# EAGLE schematic Power supply (EAGLE 9.3.0)

## Sheet 1 of 2
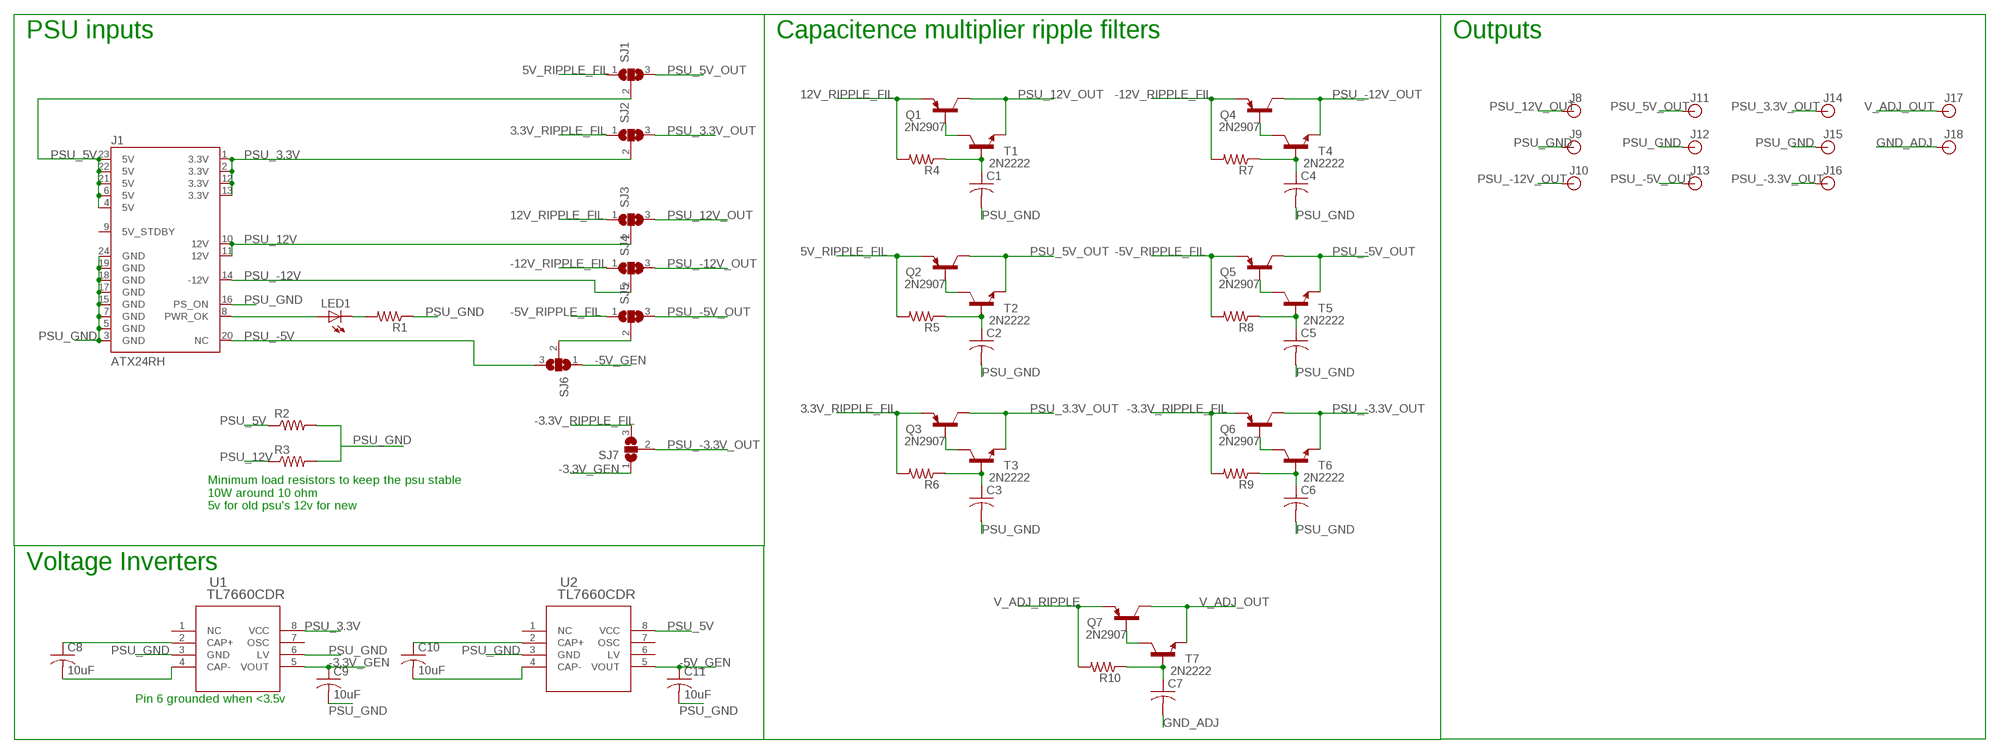
[diagram p0: schematic, sheet 1]

### Parts
C1  C-USC0603  [C0603]
C2  C-USC0603  [C0603]
C3  C-USC0603  [C0603]
C4  C-USC0603  [C0603]
C5  C-USC0603  [C0603]
C6  C-USC0603  [C0603]
C7  C-USC0603  [C0603]
C8  10uF  C-USC0603  [C0603]
C9  10uF  C-USC0603  [C0603]
C10  10uF  C-USC0603  [C0603]
C11  10uF  C-USC0603  [C0603]
J1  ATX24RH  [ATX24_RIGHT_ANGLE]
J8  BANANA_CONN  [BANANA_CONN]
J9  BANANA_CONN  [BANANA_CONN]
J10  BANANA_CONN  [BANANA_CONN]
J11  BANANA_CONN  [BANANA_CONN]
J12  BANANA_CONN  [BANANA_CONN]
J13  BANANA_CONN  [BANANA_CONN]
J14  BANANA_CONN  [BANANA_CONN]
J15  BANANA_CONN  [BANANA_CONN]
J16  BANANA_CONN  [BANANA_CONN]
J17  BANANA_CONN  [BANANA_CONN]
J18  BANANA_CONN  [BANANA_CONN]
LED1  LED3MM  [LED3MM]
Q1  2N2907  [TO92-EBC-OVAL]
Q2  2N2907  [TO92-EBC-OVAL]
Q3  2N2907  [TO92-EBC-OVAL]
Q4  2N2907  [TO92-EBC-OVAL]
Q5  2N2907  [TO92-EBC-OVAL]
Q6  2N2907  [TO92-EBC-OVAL]
Q7  2N2907  [TO92-EBC-OVAL]
R1  R-US_R0603  [R0603]
R2  R-US_0613/15  [P0613/15]
R3  R-US_0613/15  [P0613/15]
R4  R-US_R0603  [R0603]
R5  R-US_R0603  [R0603]
R6  R-US_R0603  [R0603]
R7  R-US_R0603  [R0603]
R8  R-US_R0603  [R0603]
R9  R-US_R0603  [R0603]
R10  R-US_R0603  [R0603]
SJ1  SJ2WW  [SJ_2W]
SJ2  SJ2WW  [SJ_2W]
SJ3  SJ2WW  [SJ_2W]
SJ4  SJ2WW  [SJ_2W]
SJ5  SJ2WW  [SJ_2W]
SJ6  SJ2WW  [SJ_2W]
SJ7  SJ2WW  [SJ_2W]
T1  2N2222  [TO92-EBC-OVAL]
T2  2N2222  [TO92-EBC-OVAL]
T3  2N2222  [TO92-EBC-OVAL]
T4  2N2222  [TO92-EBC-OVAL]
T5  2N2222  [TO92-EBC-OVAL]
T6  2N2222  [TO92-EBC-OVAL]
T7  2N2222  [TO92-EBC-OVAL]
U1  TL7660CDR  [D8]
U2  TL7660CDR  [D8]

### Nets
3.3V_RIPPLE_FIL: Q3.E R6.2 SJ2.1
5V_RIPPLE_FIL: Q2.E R5.2 SJ1.1
12V_RIPPLE_FIL: Q1.E R4.2 SJ3.1
-3.3V_GEN: C9.1 SJ7.1 U1.5(VOUT)
-3.3V_RIPPLE_FIL: Q6.E R9.2 SJ7.3
-5V_GEN: C11.1 SJ6.1 U2.5(VOUT)
-5V_RIPPLE_FIL: Q5.E R8.2 SJ5.1
-12V_RIPPLE_FIL: Q4.E R7.2 SJ4.1
GND_ADJ: C7.2 J18.P$1
N$1: J1.8(PWR_OK) LED1.A
N$2: LED1.K(C) R1.2
N$3: C1.1 R4.1 T1.B
N$4: SJ5.2 SJ6.2
N$5: Q1.B T1.C
N$6: Q7.B T7.C
N$7: C8.1 U1.2(CAP+)
N$8: Q2.B T2.C
N$9: C8.2 U1.4(CAP-)
N$10: C7.1 R10.1 T7.B
N$11: C2.1 R5.1 T2.B
N$12: Q3.B T3.C
N$15: C3.1 R6.1 T3.B
N$16: Q4.B T4.C
N$19: C4.1 R7.1 T4.B
N$20: Q5.B T5.C
N$21: C10.1 U2.2(CAP+)
N$22: C10.2 U2.4(CAP-)
N$23: C5.1 R8.1 T5.B
N$24: Q6.B T6.C
N$27: C6.1 R9.1 T6.B
PSU_3.3V: J1.1(3.3V) J1.2(3.3V) J1.12(3.3V) J1.13(3.3V) SJ2.2 U1.8(VCC)
PSU_3.3V_OUT: J14.P$1 Q3.C SJ2.3 T3.E
PSU_5V: J1.4(5V) J1.6(5V) J1.21(5V) J1.22(5V) J1.23(5V) R2.1 SJ1.2 U2.8(VCC)
PSU_5V_OUT: J11.P$1 Q2.C SJ1.3 T2.E
PSU_12V: J1.10(12V) J1.11(12V) R3.1 SJ3.2
PSU_12V_OUT: J8.P$1 Q1.C SJ3.3 T1.E
PSU_-3.3V_OUT: J16.P$1 Q6.C SJ7.2 T6.E
PSU_-5V: J1.20(NC) SJ6.3
PSU_-5V_OUT: J13.P$1 Q5.C SJ5.3 T5.E
PSU_-12V: J1.14(-12V) SJ4.2
PSU_-12V_OUT: J10.P$1 Q4.C SJ4.3 T4.E
PSU_GND: C1.2 C2.2 C3.2 C4.2 C5.2 C6.2 C9.2 C11.2 J1.3(GND) J1.5(GND) J1.7(GND) J1.15(GND) J1.16(PS_ON) J1.17(GND) J1.18(GND) J1.19(GND) J1.24(GND) J9.P$1 J12.P$1 J15.P$1 R1.1 R2.2 R3.2 U1.3(GND) U1.6(LV) U2.3(GND)
V_ADJ_OUT: J17.P$1 Q7.C T7.E
V_ADJ_RIPPLE: Q7.E R10.2
Unconnected: J1.9(5V_STDBY) U1.1(NC) U1.7(OSC) U2.1(NC) U2.6(LV) U2.7(OSC)

### Notes on the sheet
- PSU inputs | Capacitence multiplier ripple filters | Outputs
- Minimum load resistors to keep the psu stable
  10W around 10 ohm
  5v for old psu's 12v for new
- Voltage Inverters
- Pin 6 grounded when <3.5v

## Sheet 2 of 2
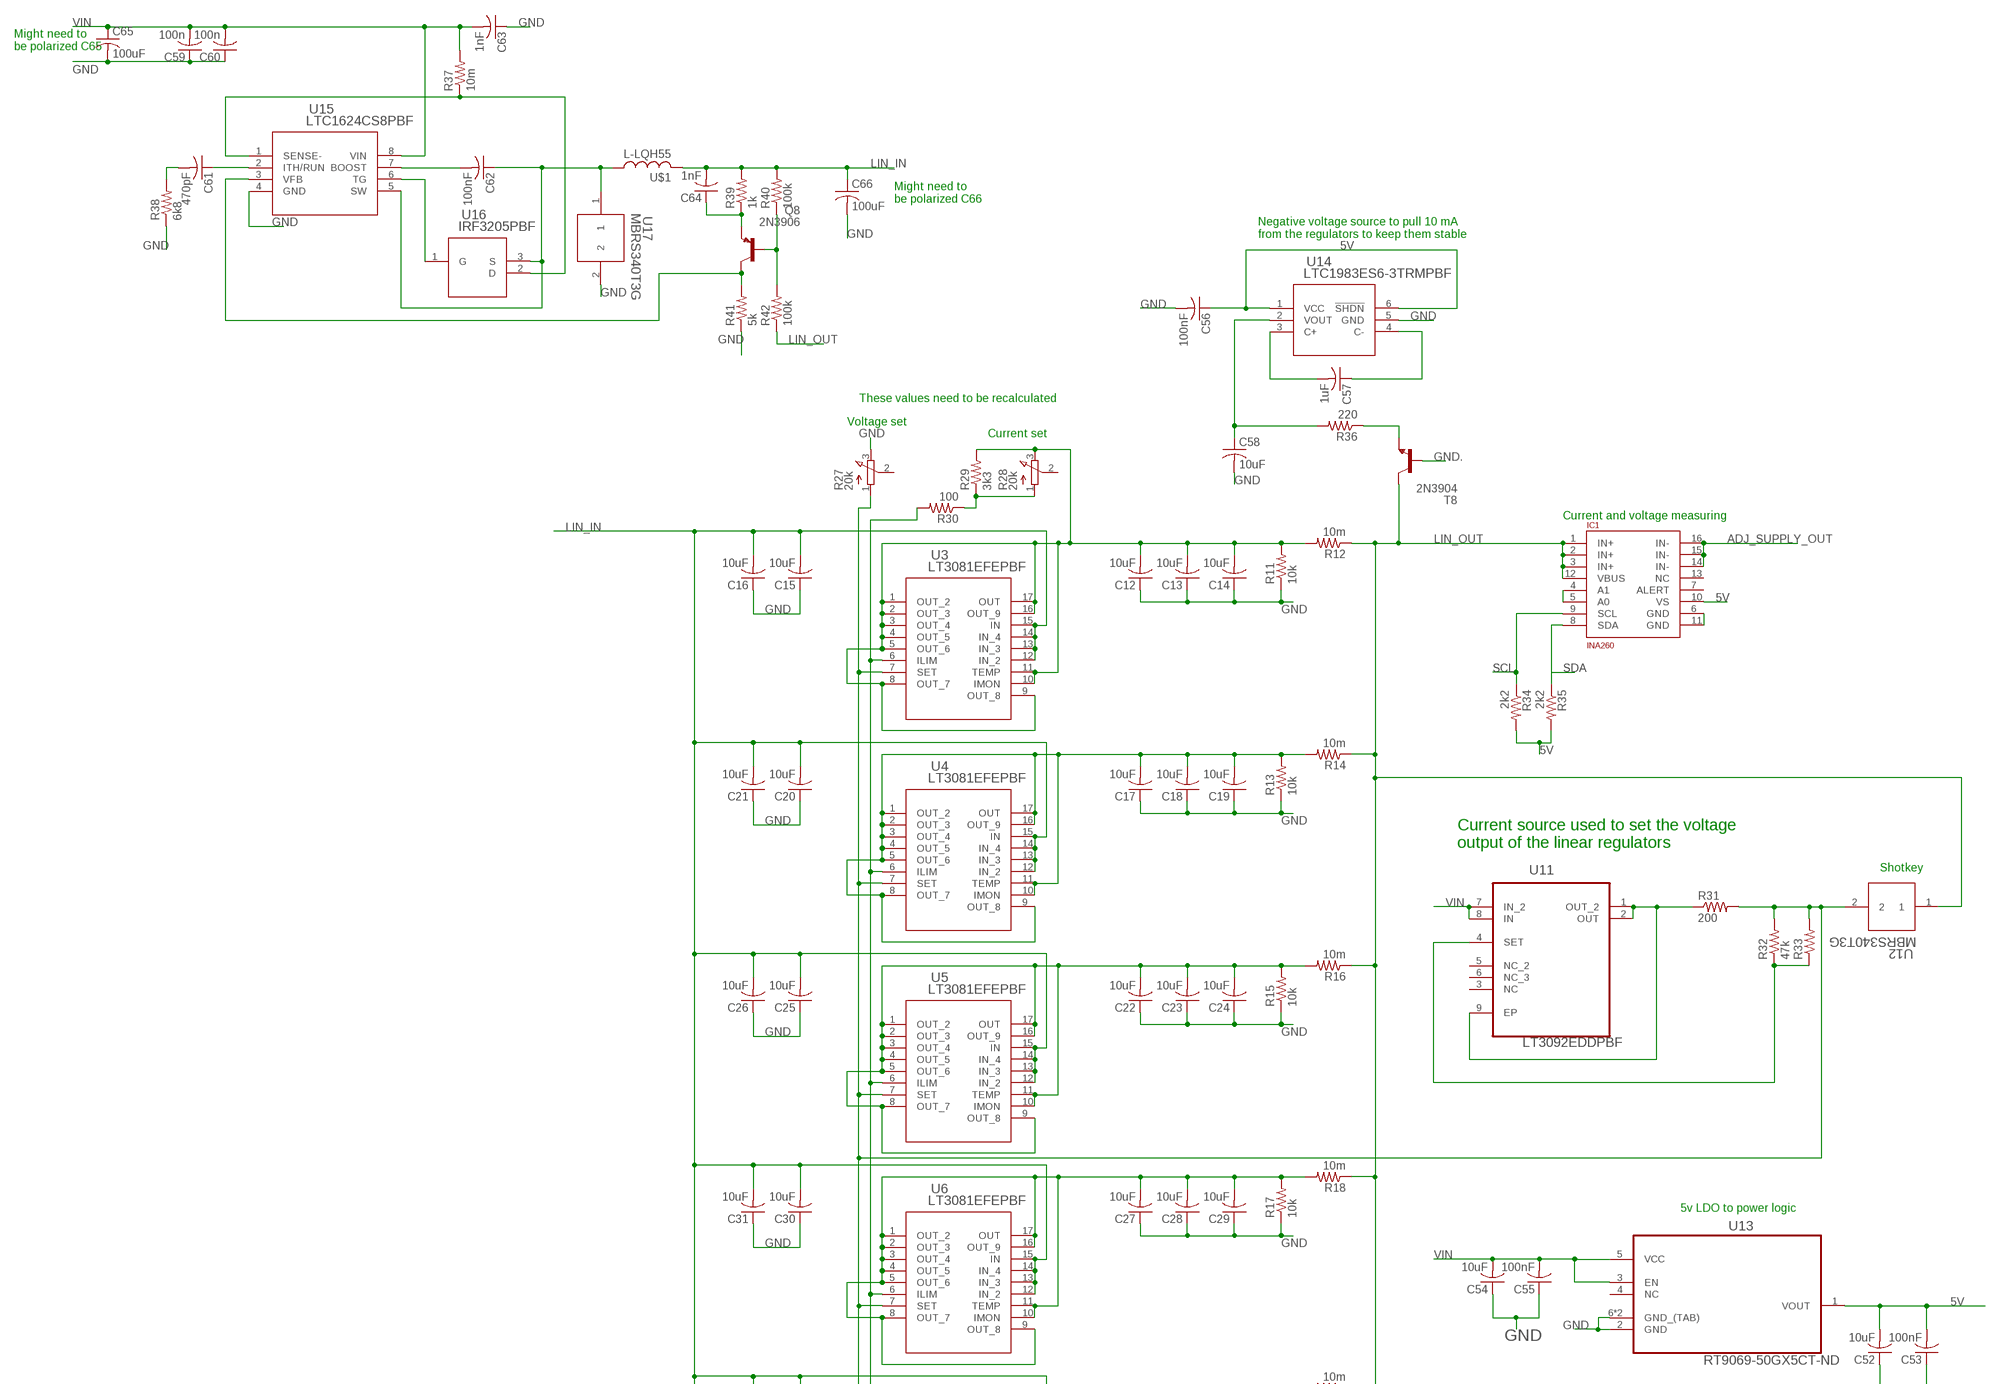
[diagram p1: schematic, sheet 2, part 1 of 2]
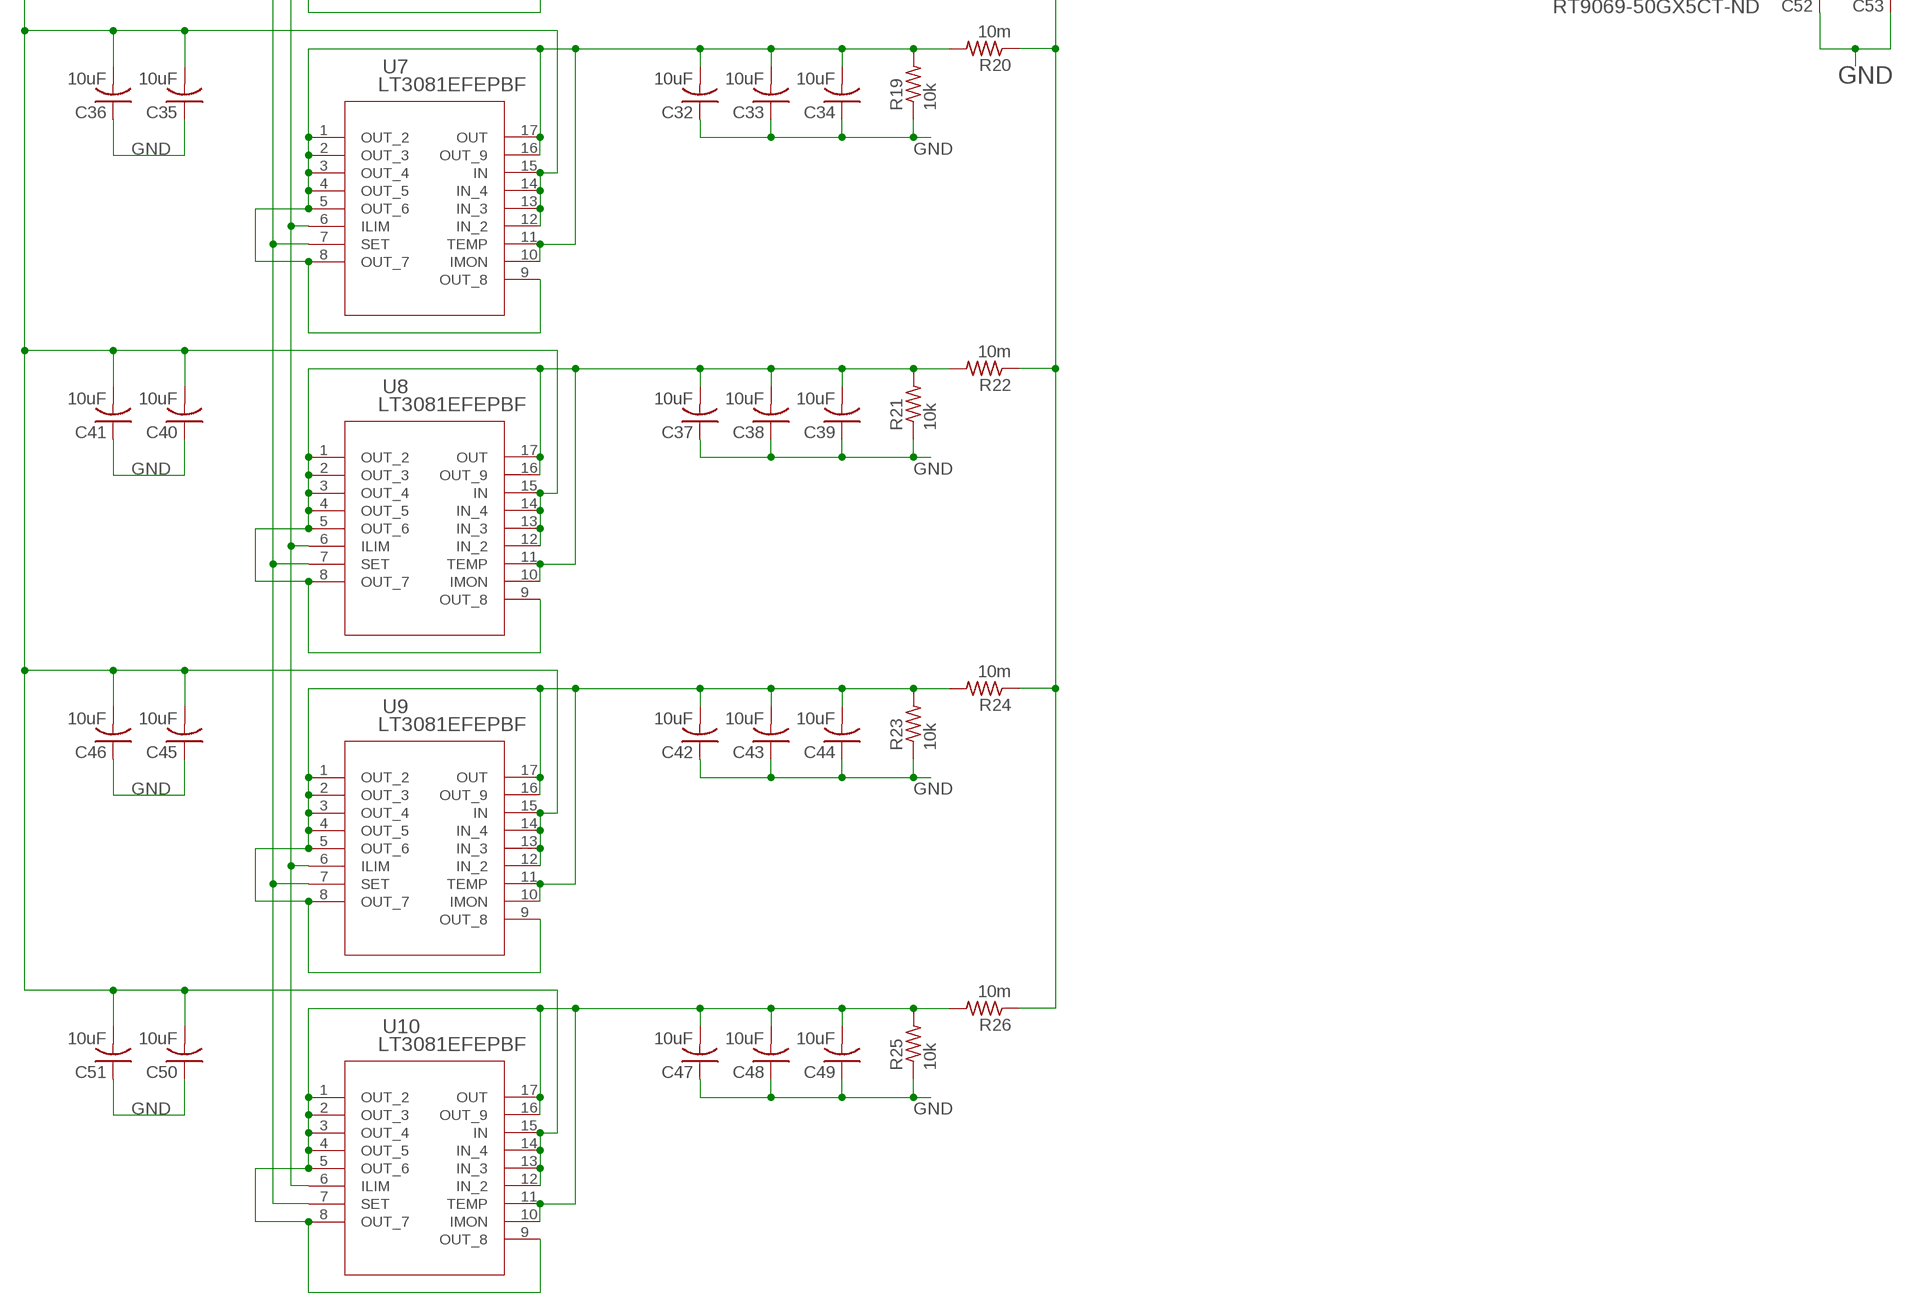
[diagram p2: schematic, sheet 2, part 2 of 2]

### Parts
C12  10uF  C-USC0805  [C0805]
C13  10uF  C-USC0805  [C0805]
C14  10uF  C-USC0805  [C0805]
C15  10uF  C-USC0805  [C0805]
C16  10uF  C-USC0805  [C0805]
C17  10uF  C-USC0805  [C0805]
C18  10uF  C-USC0805  [C0805]
C19  10uF  C-USC0805  [C0805]
C20  10uF  C-USC0805  [C0805]
C21  10uF  C-USC0805  [C0805]
C22  10uF  C-USC0805  [C0805]
C23  10uF  C-USC0805  [C0805]
C24  10uF  C-USC0805  [C0805]
C25  10uF  C-USC0805  [C0805]
C26  10uF  C-USC0805  [C0805]
C27  10uF  C-USC0805  [C0805]
C28  10uF  C-USC0805  [C0805]
C29  10uF  C-USC0805  [C0805]
C30  10uF  C-USC0805  [C0805]
C31  10uF  C-USC0805  [C0805]
C32  10uF  C-USC0805  [C0805]
C33  10uF  C-USC0805  [C0805]
C34  10uF  C-USC0805  [C0805]
C35  10uF  C-USC0805  [C0805]
C36  10uF  C-USC0805  [C0805]
C37  10uF  C-USC0805  [C0805]
C38  10uF  C-USC0805  [C0805]
C39  10uF  C-USC0805  [C0805]
C40  10uF  C-USC0805  [C0805]
C41  10uF  C-USC0805  [C0805]
C42  10uF  C-USC0805  [C0805]
C43  10uF  C-USC0805  [C0805]
C44  10uF  C-USC0805  [C0805]
C45  10uF  C-USC0805  [C0805]
C46  10uF  C-USC0805  [C0805]
C47  10uF  C-USC0805  [C0805]
C48  10uF  C-USC0805  [C0805]
C49  10uF  C-USC0805  [C0805]
C50  10uF  C-USC0805  [C0805]
C51  10uF  C-USC0805  [C0805]
C52  10uF  C-USC0805  [C0805]
C53  100nF  C-USC0805  [C0805]
C54  10uF  C-USC0805  [C0805]
C55  100nF  C-USC0805  [C0805]
C56  100nF  C-USC0805  [C0805]
C57  1uF  C-USC0805  [C0805]
C58  10uF  C-USC0805  [C0805]
C59  100n  C-USC0805  [C0805]
C60  100n  C-USC0805  [C0805]
C61  470pF  C-USC0805  [C0805]
C62  100nF  C-USC0805  [C0805]
C63  1nF  C-USC0805  [C0805]
C64  1nF  C-USC0805  [C0805]
C65  100uF  C-USC0805  [C0805]
C66  100uF  C-USC0805  [C0805]
IC1  INA260  [TSSOP16]
Q8  2N3906  [TO92]
R11  10k  R-US_R0805  [R0805]
R12  10m  R-US_R0805  [R0805]
R13  10k  R-US_R0805  [R0805]
R14  10m  R-US_R0805  [R0805]
R15  10k  R-US_R0805  [R0805]
R16  10m  R-US_R0805  [R0805]
R17  10k  R-US_R0805  [R0805]
R18  10m  R-US_R0805  [R0805]
R19  10k  R-US_R0805  [R0805]
R20  10m  R-US_R0805  [R0805]
R21  10k  R-US_R0805  [R0805]
R22  10m  R-US_R0805  [R0805]
R23  10k  R-US_R0805  [R0805]
R24  10m  R-US_R0805  [R0805]
R25  10k  R-US_R0805  [R0805]
R26  10m  R-US_R0805  [R0805]
R27  20k  3RP/1610N  [3RP/1610N]
R28  20k  3RP/1610N  [3RP/1610N]
R29  3k3  R-US_R0603  [R0603]
R30  100  R-US_R0603  [R0603]
R31  200  R-US_R0603  [R0603]
R32  47k  R-US_R0603  [R0603]
R33  R-US_R0603  [R0603]
R34  2k2  R-US_R0805  [R0805]
R35  2k2  R-US_R0805  [R0805]
R36  220  R-US_R0805  [R0805]
R37  10m  R-US_R0603  [R0603]
R38  6k8  R-US_R0603  [R0603]
R39  1k  R-US_R0603  [R0603]
R40  100k  R-US_R0603  [R0603]
R41  5k  R-US_R0603  [R0603]
R42  100k  R-US_R0603  [R0603]
T8  2N3904  [TO92]
U3  LT3081EFEPBF  [TSSOP-16_FE/BB]
U4  LT3081EFEPBF  [TSSOP-16_FE/BB]
U5  LT3081EFEPBF  [TSSOP-16_FE/BB]
U6  LT3081EFEPBF  [TSSOP-16_FE/BB]
U7  LT3081EFEPBF  [TSSOP-16_FE/BB]
U8  LT3081EFEPBF  [TSSOP-16_FE/BB]
U9  LT3081EFEPBF  [TSSOP-16_FE/BB]
U10  LT3081EFEPBF  [TSSOP-16_FE/BB]
U11  LT3092EDDPBF  [DFN300X300X80-9N]
U12  MBRS340T3G  [SMC]
U13  RT9069-50GX5CT-ND  [RT9069-50GX5CT-ND]
U14  LTC1983ES6-3TRMPBF  [SOT-23_S6]
U15  LTC1624CS8PBF  [SO-8_S]
U16  IRF3205PBF  [TO-220AB]
U17  MBRS340T3G  [SMC]
U$1  L-LQH55  [LQH55]

### Nets
5V: C52.2 C53.2 C56.1 IC1.10(VS) R34.2 R35.2 U13.1(VOUT) U14.1(VCC) U14.6(!SHDN)
ADJ_SUPPLY_OUT: IC1.14(IN-) IC1.15(IN-) IC1.16(IN-)
GND: C12.1 C13.1 C14.1 C15.1 C16.1 C17.1 C18.1 C19.1 C20.1 C21.1 C22.1 C23.1 C24.1 C25.1 C26.1 C27.1 C28.1 C29.1 C30.1 C31.1 C32.1 C33.1 C34.1 C35.1 C36.1 C37.1 C38.1 C39.1 C40.1 C41.1 C42.1 C43.1 C44.1 C45.1 C46.1 C47.1 C48.1 C49.1 C50.1 C51.1 C52.1 C53.1 C54.1 C55.1 C56.2 C58.2 C59.1 C60.1 C63.1 C65.2 C66.2 R11.1 R13.1 R15.1 R17.1 R19.1 R21.1 R23.1 R25.1 R27.3(E) R38.1 R41.1 U13.2(GND) U13.6(GND_(TAB)) U13.TAB(GND_(TAB)) U14.5(GND) U15.4(GND) U17.2
GND.: T8.2(B)
LIN_IN: C15.2 C16.2 C20.2 C21.2 C25.2 C26.2 C30.2 C31.2 C35.2 C36.2 C40.2 C41.2 C45.2 C46.2 C50.2 C51.2 C64.2 C66.1 R39.2 R40.2 U3.12(IN_2) U3.13(IN_3) U3.14(IN_4) U3.15(IN) U4.12(IN_2) U4.13(IN_3) U4.14(IN_4) U4.15(IN) U5.12(IN_2) U5.13(IN_3) U5.14(IN_4) U5.15(IN) U6.12(IN_2) U6.13(IN_3) U6.14(IN_4) U6.15(IN) U7.12(IN_2) U7.13(IN_3) U7.14(IN_4) U7.15(IN) U8.12(IN_2) U8.13(IN_3) U8.14(IN_4) U8.15(IN) U9.12(IN_2) U9.13(IN_3) U9.14(IN_4) U9.15(IN) U10.12(IN_2) U10.13(IN_3) U10.14(IN_4) U10.15(IN) U$1.2
LIN_OUT: IC1.1(IN+) IC1.2(IN+) IC1.3(IN+) IC1.12(VBUS) R12.1 R14.1 R16.1 R18.1 R20.1 R22.1 R24.1 R26.1 R42.1 T8.1(C) U12.1
N$14: C58.1 R36.2 U14.2(VOUT)
N$17: R31.1 U11.1(OUT_2) U11.2(OUT) U11.9(EP)
N$18: C17.2 C18.2 C19.2 R13.2 R14.2 U4.1(OUT_2) U4.2(OUT_3) U4.3(OUT_4) U4.4(OUT_5) U4.5(OUT_6) U4.8(OUT_7) U4.9(OUT_8) U4.10(IMON) U4.11(TEMP) U4.16(OUT_9) U4.17(OUT)
N$25: R27.1(A) R31.2 R32.2 R33.2 U3.7(SET) U4.7(SET) U5.7(SET) U6.7(SET) U7.7(SET) U8.7(SET) U9.7(SET) U10.7(SET) U12.2
N$26: R32.1 R33.1 U11.4(SET)
N$28: C22.2 C23.2 C24.2 R15.2 R16.2 U5.1(OUT_2) U5.2(OUT_3) U5.3(OUT_4) U5.4(OUT_5) U5.5(OUT_6) U5.8(OUT_7) U5.9(OUT_8) U5.10(IMON) U5.11(TEMP) U5.16(OUT_9) U5.17(OUT)
N$29: IC1.4(A1) IC1.5(A0)
N$30: C27.2 C28.2 C29.2 R17.2 R18.2 U6.1(OUT_2) U6.2(OUT_3) U6.3(OUT_4) U6.4(OUT_5) U6.5(OUT_6) U6.8(OUT_7) U6.9(OUT_8) U6.10(IMON) U6.11(TEMP) U6.16(OUT_9) U6.17(OUT)
N$31: IC1.6(GND) IC1.11(GND)
N$32: C32.2 C33.2 C34.2 R19.2 R20.2 U7.1(OUT_2) U7.2(OUT_3) U7.3(OUT_4) U7.4(OUT_5) U7.5(OUT_6) U7.8(OUT_7) U7.9(OUT_8) U7.10(IMON) U7.11(TEMP) U7.16(OUT_9) U7.17(OUT)
N$33: C57.2 U14.3(C+)
N$34: C37.2 C38.2 C39.2 R21.2 R22.2 U8.1(OUT_2) U8.2(OUT_3) U8.3(OUT_4) U8.4(OUT_5) U8.5(OUT_6) U8.8(OUT_7) U8.9(OUT_8) U8.10(IMON) U8.11(TEMP) U8.16(OUT_9) U8.17(OUT)
N$35: C57.1 U14.4(C-)
N$36: C42.2 C43.2 C44.2 R23.2 R24.2 U9.1(OUT_2) U9.2(OUT_3) U9.3(OUT_4) U9.4(OUT_5) U9.5(OUT_6) U9.8(OUT_7) U9.9(OUT_8) U9.10(IMON) U9.11(TEMP) U9.16(OUT_9) U9.17(OUT)
N$37: R36.1 T8.3(E)
N$38: C47.2 C48.2 C49.2 R25.2 R26.2 U10.1(OUT_2) U10.2(OUT_3) U10.3(OUT_4) U10.4(OUT_5) U10.5(OUT_6) U10.8(OUT_7) U10.9(OUT_8) U10.10(IMON) U10.11(TEMP) U10.16(OUT_9) U10.17(OUT)
N$39: C12.2 C13.2 C14.2 R11.2 R12.2 R28.3(E) R29.2 U3.1(OUT_2) U3.2(OUT_3) U3.3(OUT_4) U3.4(OUT_5) U3.5(OUT_6) U3.8(OUT_7) U3.9(OUT_8) U3.10(IMON) U3.11(TEMP) U3.16(OUT_9) U3.17(OUT)
N$40: R28.1(A) R29.1 R30.1
N$41: R37.1 U15.1(SENSE-) U16.2(D)
N$42: C62.2 U15.7(BOOST)
N$43: C61.1 U15.2(ITH/RUN)
N$44: C61.2 R38.2
N$45: U15.6(TG) U16.1(G)
N$46: R30.2 U3.6(ILIM) U4.6(ILIM) U5.6(ILIM) U6.6(ILIM) U7.6(ILIM) U8.6(ILIM) U9.6(ILIM) U10.6(ILIM)
N$47: C64.1 Q8.3(E) R39.1
N$48: Q8.2(B) R40.1 R42.2
N$49: Q8.1(C) R41.2 U15.3(VFB)
N$51: C62.1 U15.5(SW) U16.3(S) U17.1 U$1.1
SCL: IC1.9(SCL) R34.1
SDA: IC1.8(SDA) R35.1
VIN: C54.2 C55.2 C59.2 C60.2 C63.2 C65.1 R37.2 U11.7(IN_2) U11.8(IN) U13.3(EN) U13.5(VCC) U15.8(VIN)
Unconnected: IC1.7(ALERT) IC1.13(NC) R27.2(S) R28.2(S) U11.3(NC) U11.5(NC_2) U11.6(NC_3) U13.4(NC)

### Notes on the sheet
- Might need to 
  be polarized C65
- Might need to 
  be polarized C66
- Negative voltage source to pull 10 mA 
  from the regulators to keep them stable
- These values need to be recalculated
- Voltage set
- Current set
- Current and voltage measuring
- Current source used to set the voltage 
  output of the linear regulators
- Shotkey
- 5v LDO to power logic

## Library data of the parts
C1-C66 = adafruit:C-US: CAPACITOR, American symbol
IC1 = vtgs:INA260
J1 = SparkFun-Connectors:ATX24: ATX24 Pin Power Supply Connector - Right Angle PTH Mount This is a good connector for connecting a computer power supply to a PCB. It's massive, but provides many amps of power at 5V and 12V. SparkFun Products: SparkFun Benchtop Power Board Kit <https://www.sparkfun.com/products/12867> SparkFun Power Driver Shield Kit <https://www.sparkfun.com/products/10618>; PROD_ID: CONN-09674; SF_ID: PRT-09498
J8-J18 = SparkFun-Connectors:BANANA_CONN: Through-hole Banana Jack Basic PTH connection for banana jack plugs SparkFun Products: Multimeter Kit <https://www.sparkfun.com/products/retired/10956> Banana to Alligator Cable <https://www.sparkfun.com/products/retired/509> Banana to Alligator Coax Cable <https://www.sparkfun.com/products/retired/508> Banana to Banana Cable <https://www.sparkfun.com/products/retired/507> Banana to IC Hook Cables <https://www.sparkfun.com/products/retired/506>
LED1 = adafruit:LED: LED OSRAM: - CHIPLED LG R971, LG N971, LY N971, LG Q971, LY Q971, LO R971, LY R971 LH N974, LH R974 LS Q976, LO Q976, LY Q976 LO Q996 - Hyper CHIPLED LW Q18S LB Q993, LB Q99A, LB R99A - SideLED LS A670, LO A670, LY A670, LG A670, LP A670 LB A673, LV A673, LT A673, LW A673 LH A674 LY A675 LS A676, LA A676, LO A676, LY A676, LW A676 LS A679, LY A679, LG A679 - Hyper Micro SIDELED® LS Y876, LA Y876, LO Y876, LY Y876 LT Y87S - SmartLED LW L88C, LW L88S LB L89C, LB L89S, LG L890 LS L89K, LO L89K, LY L89K LS L896, LA L896, LO L896, LY L896 - TOPLED LS T670, LO T670, LY T670, LG T670, LP T670 LSG T670, LSP T670, LSY T670, LOP T670, LYG T670 LG T671, LOG T671, LSG T671 LB T673, LV T673, LT T673, LW T673 LH T674 LS T676, LA T676, LO T676, LY T676, LB T676, LH T676, LSB T676, LW T676 LB T67C, LV T67C, LT T67C, LS T67K, LO T67K, LY T67K, LW E67C LS E67B, LA E67B, LO E67B, LY E67B, LB E67C, LV E67C, LT E67C LW T67C LS T679, LY T679, LG T679 LS T770, LO T770, LY T770, LG T770, LP T770 LB T773, LV T773, LT T773, LW T773 LH T774 LS E675, LA E675, LY E675, LS T675 LS T776, LA T776, LO T776, LY T776, LB T776 LHGB T686 LT T68C, LB T68C - Hyper Mini TOPLED® LB M676 - Mini TOPLED Santana® LG M470 LS M47K, LO M47K, LY M47K Source: http://www.osram.convergy.de/
Q1-Q7 = adafruit:2N2907*: PNP Transistor Big Oval pads
Q8 = transistor-pnp:2N3906: PNP Transistor
R1-R26 R29-R42 = adafruit:R-US_: RESISTOR, American symbol
R27 R28 = pot:3RP/1610N: 16mm Potentiometer one level Source: http://www.alphapotentiometers.net/html/16mm_pot_2.html
SJ1-SJ7 = jumper:SJ2W: SMD solder JUMPER
T1-T7 = adafruit:2N2222: NPN TRANSISTOR Big oval pads
T8 = transistor:2N3904: NPN TRANSISTOR
U1 U2 = DigiKey:TL7660CDR; MANUFACTURER_PART_NUMBER: TL7660CDR; VENDOR: Texas Instruments
U3-U10 = DigiKey:LT3081EFEPBF; MANUFACTURER_PART_NUMBER: LT3081EFE#PBF; VENDOR: Linear Technology
U11 = LTC_By_element14_Batch_1:LT3092EDDPBF: 200mA 2-Terminal Programmable Current Source; MPN: LT3092EDD#PBF; OC_FARNELL: -; OC_NEWARK: 72R5810; PACKAGE: DFN-8; SUPPLIER: Linear Technology
U12 U17 = DigiKey:MBRS340T3G; MANUFACTURER_PART_NUMBER: MBRS340T3G; VENDOR: ON Semiconductor
U13 = XC6210B332PR:RT9069-50GX5CT-ND: IC, LDO VOLT REG, 3V, 1A; AVAILABILITY: Good; DESCRIPTION: Ic, Linear Regulator; Max. Input, 6v; Output, 3v; 1000ma; Accuracy, 0.5%; Sot223-5; MF: Microchip; MP: MCP1826T-3002E/DC; PACKAGE: SOT-223 Microchip; PRICE: 0.59 USD
U14 = DigiKey:LTC1983ES6-3TRMPBF; MANUFACTURER_PART_NUMBER: LTC1983ES63#TRMPBF; VENDOR: Linear Technology
U15 = DigiKey:LTC1624CS8PBF; MANUFACTURER_PART_NUMBER: LTC1624CS8#PBF; VENDOR: Linear Technology
U16 = DigiKey:IRF3205PBF; MANUFACTURER_PART_NUMBER: IRF3205PBF; VENDOR: LITEON
U$1 = adafruit:L